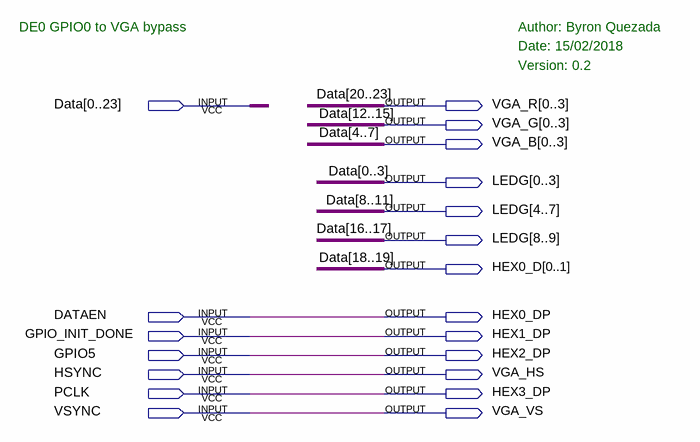
[diagram p0: schematic sheet]
// Quartus schematic vga_out.bdf as structural Verilog: 0 symbols, 20 pins
module vga_out (
  input  [0:23] Data,
  input  DATAEN,
  input  GPIO_INIT_DONE,
  input  GPIO5,
  input  HSYNC,
  input  PCLK,
  input  VSYNC,
  output [0:3] VGA_R,
  output [0:3] VGA_G,
  output [0:3] VGA_B,
  output [0:9] LEDG,
  output [0:1] HEX0_D,
  output HEX0_DP,
  output HEX1_DP,
  output HEX2_DP,
  output VGA_HS,
  output HEX3_DP,
  output VGA_VS
);


  assign HEX0_D = Data[18:19];
  assign HEX0_DP = DATAEN;
  assign HEX1_DP = GPIO_INIT_DONE;
  assign HEX2_DP = GPIO5;
  assign HEX3_DP = PCLK;
  assign LEDG = {Data[0:3], Data[8:11], Data[16:17]};
  assign VGA_B = Data[4:7];
  assign VGA_G = Data[12:15];
  assign VGA_HS = HSYNC;
  assign VGA_R = Data[20:23];
  assign VGA_VS = VSYNC;

  // Notes on the sheet:
  //   DE0 GPIO0 to VGA bypass
  //   Author: Byron Quezada
  //   Date: 15/02/2018
  //   Version: 0.2
endmodule
